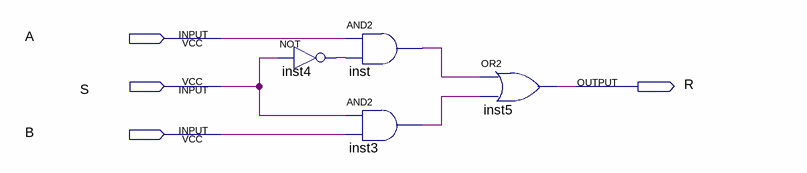
[diagram p0: schematic sheet]
// Quartus schematic mux2.bdf as structural Verilog: 4 symbols, 4 pins
module mux2 (
  input  A,
  input  S,
  input  B,
  output R
);

  wire inst3_out, inst4_out, inst_out;

  not inst4 (inst4_out, S);
  and inst (inst_out, A, inst4_out);
  and inst3 (inst3_out, S, B);
  or inst5 (R, inst_out, inst3_out);
endmodule
